# Altium schematic sheet MPU9250.SchDoc
size A4
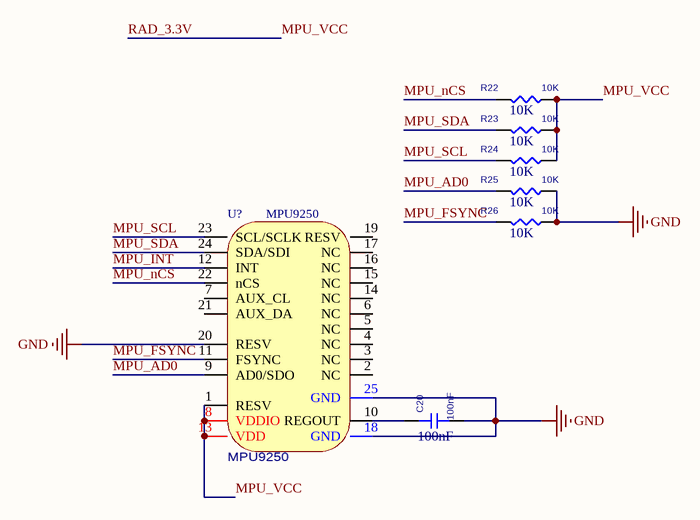
[diagram p0: MPU9250.SchDoc]

## Parts
C20  100nF  [C0603]
R22  10K  [R0603]
R23  10K  [R0603]
R24  10K  [R0603]
R25  10K  [R0603]
R26  10K  [R0603]
U7  MPU9250  [MPU9250]

## Nets
GND: C20.1 R25.2 R26.2 U7.18(GND) U7.20(RESV) U7.25(GND)
MPU_AD0: R25.1 U7.9(AD0/SDO)
MPU_FSYNC: R26.1 U7.11(FSYNC)
MPU_INT: U7.12(INT)
MPU_nCS: R22.1 U7.22(nCS)
MPU_SCL: R24.1 U7.23(SCL/SCLK)
MPU_SDA: R23.1 U7.24(SDA/SDI)
MPU_VCC: R22.2 R23.2 R24.2 U7.1(RESV) U7.8(VDDIO) U7.13(VDD)  [also labelled RAD_3.3V]
NetC20_2: C20.2 U7.10(REGOUT)

Not connected (* = marked no-connect by the designer): U7 2(NC) 3(NC) 4(NC) 5(NC) 6(NC) 7(AUX_CL) 14(NC) 15(NC) 16(NC) 17(NC) 19(RESV) 21(AUX_DA)

## Notes on the sheet
- (in symbol MPU9250) U?

## Library data of the parts
C20 = CAP1: VC2: 0; MAX_TEMP: CTMAX; SLOPE: CSMAX; KNEE: CBMAX; CURRENT: CIMAX; VOLTAGE: CMAX; PSpiceTemplate: C^@REFDES %1 %2 ?TOLERANCE|C^@REFDES| @VALUE ?IC/IC=@IC/ TC=@TC1,@TC2 ?TOLERANCE|\n.model C^@REFDES CAP C=1 DEV=@TOLERANCE% TC1=@TC1 TC2=@TC2 VC1=@VC1 VC2=@VC2|; DIST: FLAT; VC1: 0; TC1: 0; TC2: 0; Value: 100nF
R22-R26 = RES1: DIST: FLAT; PSpiceTemplate: R^@REFDES %1 %2 ?TOLERANCE|R^@REFDES| @VALUE TC=@TC1,@TC2 ?TOLERANCE|\n.model R^@REFDES RES R=1 DEV=@TOLERANCE% TC1=@TC1 TC2=@TC2|; VOLTAGE: RVMAX; SLOPE: RSMAX; MAX_TEMP: RTMAX; POWER: RMAX; TC1: 0; TC2: 0; Value: 10K